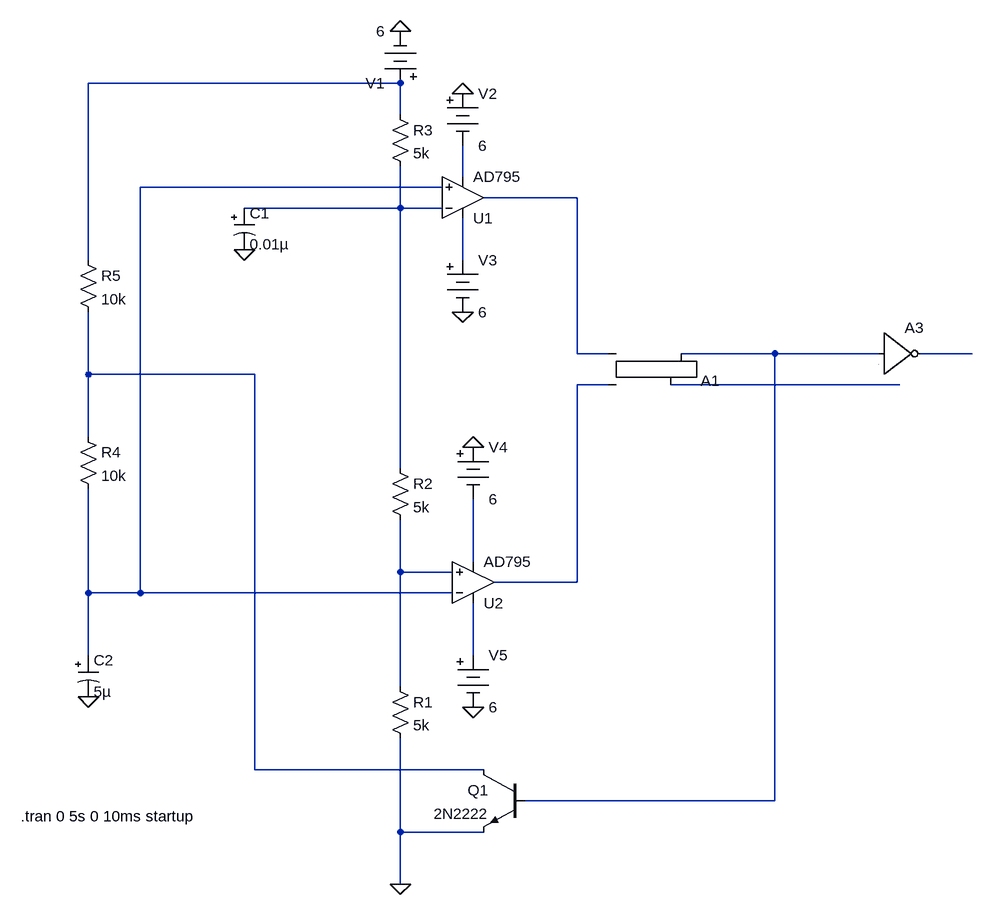
[diagram p0: schematic 555Astable.asc]
555Astable.asc, the LTspice schematic file:
Version 4
SHEET 1 1300 964
WIRE 16 -288 16 -304
WIRE 16 -288 -464 -288
WIRE 16 -240 16 -288
WIRE 112 -144 112 -192
WIRE 80 -128 -384 -128
WIRE 288 -112 144 -112
WIRE 16 -96 16 -160
WIRE 16 -96 -224 -96
WIRE 80 -96 16 -96
WIRE -464 -16 -464 -288
WIRE 112 -16 112 -80
WIRE 288 128 288 -112
WIRE 336 128 288 128
WIRE 592 128 448 128
WIRE 752 128 592 128
WIRE 896 128 816 128
WIRE -464 160 -464 64
WIRE -208 160 -464 160
WIRE 336 176 288 176
WIRE 784 176 432 176
WIRE -464 256 -464 160
WIRE 16 304 16 -96
WIRE 128 448 128 352
WIRE 16 464 16 384
WIRE 96 464 16 464
WIRE 288 480 288 176
WIRE 288 480 160 480
WIRE -464 496 -464 336
WIRE -384 496 -384 -128
WIRE -384 496 -464 496
WIRE 96 496 -384 496
WIRE -464 592 -464 496
WIRE 128 592 128 512
WIRE 16 640 16 464
WIRE -208 768 -208 160
WIRE 144 768 -208 768
WIRE 592 816 592 128
WIRE 592 816 208 816
WIRE 16 864 16 720
WIRE 144 864 16 864
WIRE 16 944 16 864
FLAG 16 944 0
FLAG -224 -32 0
FLAG -464 656 0
FLAG 16 -368 0
FLAG 112 -272 0
FLAG 112 64 0
FLAG 128 272 0
FLAG 128 672 0
DATAFLAG 864 128 ""
DATAFLAG 656 128 ""
DATAFLAG 672 176 ""
DATAFLAG 672 176 ""
DATAFLAG 672 176 ""
DATAFLAG 672 176 ""
SYMBOL res 0 624 R0
SYMATTR InstName R1
SYMATTR Value 5k
SYMBOL res 0 288 R0
SYMATTR InstName R2
SYMATTR Value 5k
SYMBOL res 0 -256 R0
SYMATTR InstName R3
SYMATTR Value 5k
SYMBOL Misc\\battery 16 -272 R180
WINDOW 123 0 0 Left 0
WINDOW 39 0 0 Left 0
SYMATTR InstName V1
SYMATTR Value 6
SYMBOL res -480 240 R0
SYMATTR InstName R4
SYMATTR Value 10k
SYMBOL res -480 -32 R0
SYMATTR InstName R5
SYMATTR Value 10k
SYMBOL polcap -240 -96 R0
SYMATTR InstName C1
SYMATTR Value 0.01µ
SYMBOL polcap -480 592 R0
SYMATTR InstName C2
SYMATTR Value 5µ
SYMBOL Misc\\battery 112 -288 R0
WINDOW 123 0 0 Left 0
WINDOW 39 0 0 Left 0
SYMATTR InstName V2
SYMATTR Value 6
SYMBOL Misc\\battery 112 -32 R0
WINDOW 123 0 0 Left 0
WINDOW 39 0 0 Left 0
SYMATTR InstName V3
SYMATTR Value 6
SYMBOL Misc\\battery 128 256 R0
WINDOW 123 0 0 Left 0
WINDOW 39 0 0 Left 0
SYMATTR InstName V4
SYMATTR Value 6
SYMBOL Misc\\battery 128 576 R0
WINDOW 123 0 0 Left 0
WINDOW 39 0 0 Left 0
SYMATTR InstName V5
SYMATTR Value 6
SYMBOL npn 208 768 M0
SYMATTR InstName Q1
SYMATTR Value 2N2222
SYMBOL Digital\\srflop 384 224 M180
SYMATTR InstName A1
SYMATTR SpiceLine Vhigh=6 Vlow=0 Ref=0.5
SYMBOL Digital\\inv 752 64 R0
SYMATTR InstName A3
SYMATTR SpiceLine Vhigh=6 Vlow=0 Ref=0.5
SYMBOL OpAmps\\AD795 112 -48 M180
SYMATTR InstName U1
SYMBOL OpAmps\\AD795 128 544 M180
SYMATTR InstName U2
TEXT -568 840 Left 2 !.tran 0 5s 0 10ms startup

The netlist it stands for:
* 555Astable.asc
R1 N013 0 5k
R2 N005 N013 5k
R3 N001 N005 5k
V1 N001 0 6
R4 N009 N003 10k
R5 N001 N009 10k
C1 N005 0 0.01µ
C2 N003 0 5µ
V2 0 N002 6
V3 N006 0 6
V4 0 N012 6
V5 N014 0 6
Q1 N009 N007 0 0 2N2222
A1 N010 N004 0 0 0 N007 N011 0 SRFLOP Vhigh=6 Vlow=0 Ref=0.5
A3 N007 0 0 0 0 N008 0 0 BUF Vhigh=6 Vlow=0 Ref=0.5
XU1 N003 N005 N006 N002 N004 AD795  ; pins In+ In- V+ V- OUT
XU2 N013 N003 N014 N012 N010 AD795  ; pins In+ In- V+ V- OUT
.model NPN NPN
.model PNP PNP
.lib standard.bjt
.tran 0 5s 0 10ms startup
.lib ADI1.lib
.backanno
.end